# EAGLE design mcb (EAGLE 7.6.0)
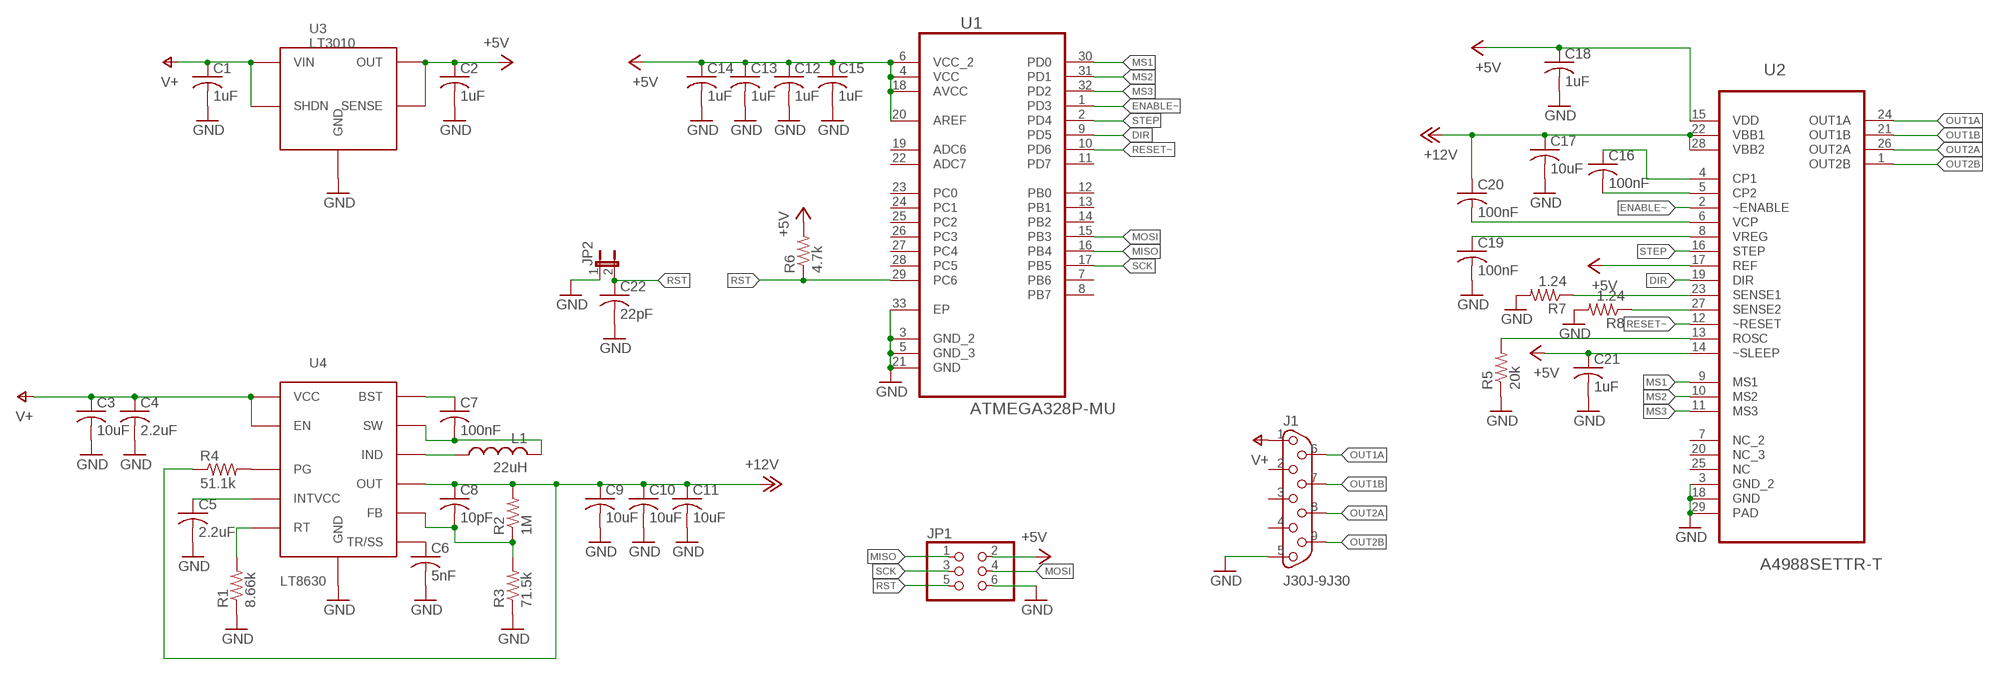
[diagram p0: schematic, sheet 1]

## Parts
C1  1uF  C-USC0603  [C0603]
C2  1uF  C-USC0603  [C0603]
C3  10uF  C-USC1206  [C1206]
C4  2.2uF  C-USC0805  [C0805]
C5  2.2uF  C-USC0805  [C0805]
C6  5nF  C-USC0603  [C0603]
C7  100nF  C-USC0603  [C0603]
C8  10pF  C-USC0603  [C0603]
C9  10uF  C-USC1206  [C1206]
C10  10uF  C-USC1206  [C1206]
C11  10uF  C-USC1206  [C1206]
C12  1uF  C-USC0603  [C0603]
C13  1uF  C-USC0603  [C0603]
C14  1uF  C-USC0603  [C0603]
C15  1uF  C-USC0603  [C0603]
C16  100nF  C-USC0603  [C0603]
C17  10uF  C-USC1206  [C1206]
C18  1uF  C-USC0603  [C0603]
C19  100nF  C-USC0603  [C0603]
C20  100nF  C-USC0603  [C0603]
C21  1uF  C-USC0603  [C0603]
C22  22pF  C-USC0603  [C0603]
J1  J30J-9J30  [ZKN-9-J30]
JP1  PINHD-2X3  [2X03]
JP2  JUMPER-2SMD-NO  [SJ_2S-NO]
L1  22uH  INDUCTOR  [SRP1265A]
R1  8.66k  R-US_R0603  [R0603]
R2  1M  R-US_R0603  [R0603]
R3  71.5k  R-US_R0603  [R0603]
R4  51.1k  R-US_R0603  [R0603]
R5  20k  R-US_R0603  [R0603]
R6  4.7k  R-US_R0603  [R0603]
R7  1.24  R-US_R0603  [R0603]
R8  1.24  R-US_R0603  [R0603]
U1  ATMEGA328P-MU  [QFN50P500X500X100-33N]
U2  A4988SETTR-T  [QFN50P500X500X100-29N]
U3  LT3010  [8-MSOP]
U4  LT8630  [20-TSSOP]

## Nets
+5V: C2.1 C12.1 C13.1 C14.1 C15.1 C18.1 C21.1 JP1.2 R6.2 U1.4(VCC) U1.6(VCC_2) U1.18(AVCC) U1.20(AREF) U2.14(~SLEEP) U2.15(VDD) U2.17(REF) U3.1(OUT) U3.2(SENSE)
+12V: C8.1 C9.1 C10.1 C11.1 C17.1 C20.1 R2.2 R4.1 U2.22(VBB1) U2.28(VBB2) U4.P$12(OUT)
DIR: U1.9(PD5) U2.19(DIR)
ENABLE~: U1.1(PD3) U2.2(~ENABLE)
GND: C1.2 C2.2 C3.2 C4.2 C5.2 C6.2 C9.2 C10.2 C11.2 C12.2 C13.2 C14.2 C15.2 C17.2 C18.2 C19.2 C21.2 C22.2 J1.5 JP1.6 JP2.1 R1.1 R3.1 R5.1 R7.2 R8.2 U1.3(GND_2) U1.5(GND_3) U1.21(GND) U1.33(EP) U2.3(GND_2) U2.18(GND) U2.29(PAD) U3.3(GND) U3.4(GND) U3.6(GND) U3.7(GND) U3.9(GND) U4.P$0(GND)
MISO: JP1.1 U1.16(PB4)
MOSI: JP1.4 U1.15(PB3)
MS1: U1.30(PD0) U2.9(MS1)
MS2: U1.31(PD1) U2.10(MS2)
MS3: U1.32(PD2) U2.11(MS3)
N$1: C6.1 U4.P$10(TR/SS)
N$2: C16.1 U2.4(CP1)
N$3: R4.2 U4.P$5(PG)
N$4: C5.1 U4.P$16(INTVCC)
N$5: R1.2 U4.P$8(RT)
N$6: R7.1 U2.23(SENSE1)
N$7: C7.1 U4.P$18(BST)
N$8: C7.2 L1.P$2 U4.P$20(SW)
N$9: C20.2 U2.6(VCP)
N$10: C8.2 R2.1 R3.2 U4.P$11(FB)
N$11: L1.P$1 U4.P$14(IND)
N$12: C16.2 U2.5(CP2)
N$13: R5.2 U2.13(ROSC)
N$14: C19.1 U2.8(VREG)
N$15: R8.1 U2.27(SENSE2)
OUT1A: J1.6 U2.24(OUT1A)
OUT1B: J1.7 U2.21(OUT1B)
OUT2A: J1.8 U2.26(OUT2A)
OUT2B: J1.9 U2.1(OUT2B)
RESET~: U1.10(PD6) U2.12(~RESET)
RST: C22.1 JP1.5 JP2.2 R6.1 U1.29(PC6)
SCK: JP1.3 U1.17(PB5)
STEP: U1.2(PD4) U2.16(STEP)
V+: C1.1 C3.1 C4.1 J1.1 U3.5(SHDN) U3.8(VIN) U4.P$1(VCC) U4.P$3(EN)
Unconnected: J1.2 J1.3 J1.4 U1.7(PB6) U1.8(PB7) U1.11(PD7) U1.12(PB0) U1.13(PB1) U1.14(PB2) U1.19(ADC6) U1.22(ADC7) U1.23(PC0) U1.24(PC1) U1.25(PC2) U1.26(PC3) U1.27(PC4) U1.28(PC5) U2.7(NC_2) U2.20(NC_3) U2.25(NC)

## Library data of the parts
C1-C22 = resistor:C-US: CAPACITOR, American symbol
J1 = CM_J30J:J30J-9
JP1 = pinhead:PINHD-2X3: PIN HEADER
JP2 = CM_passives:JUMPER-2: Jumper Basic 0.1" spaced jumper. Use with breakaway headers.
L1 = AR_passives:INDUCTOR
R1-R8 = resistor:R-US_: RESISTOR, American symbol
U1 = Atmel_By_element14_Batch_1-00:ATMEGA328P-MU: Programmable Flash; MPN: ATMEGA328P-MU; OC_FARNELL: 1748522; OC_NEWARK: 26R2526; PACKAGE: QFN-32; SUPPLIER: Atmel
U2 = Allegro_By_element14_Batch_1:A4988SETTR-T: DMOS Microstepping Driver with Translator and Overcurrent Protection; MPN: A4988SETTR-T; OC_FARNELL: -; OC_NEWARK: 67R9678; PACKAGE: QFN-28; SUPPLIER: Allegro
U3 = AR_IC:LT3010
U4 = AR_IC:LT8630

## Board
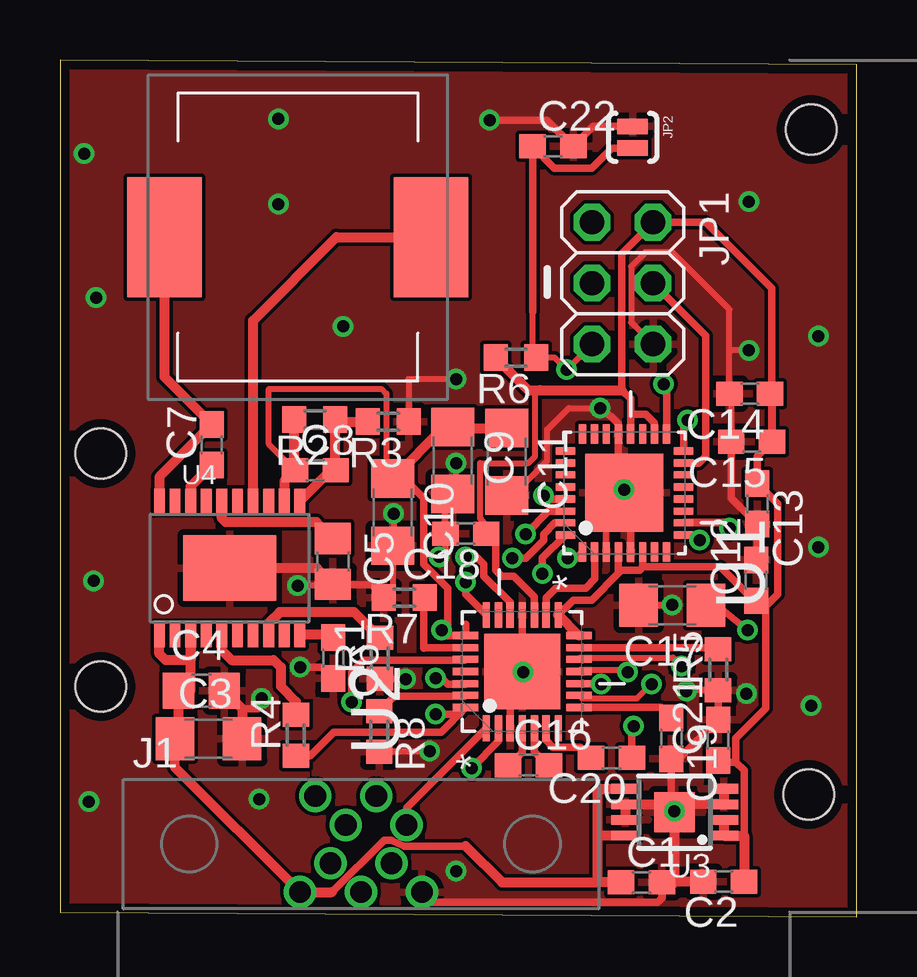
[diagram p1: board, top side]
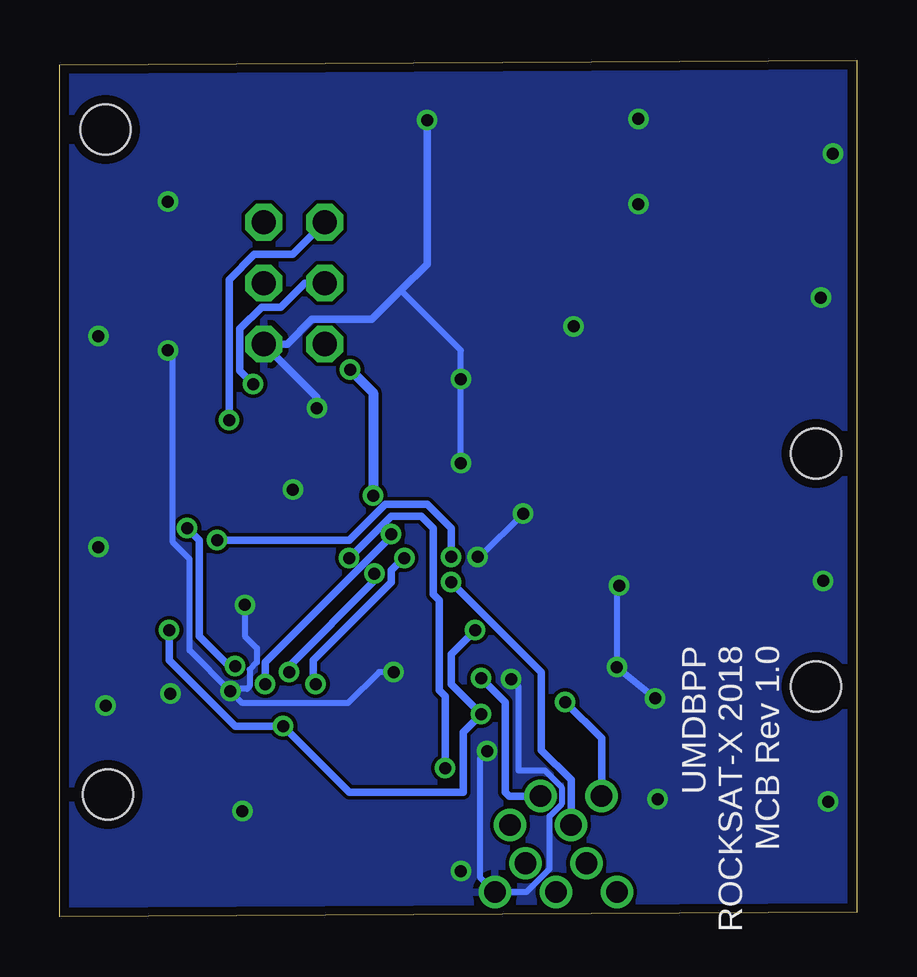
[diagram p2: board, bottom side, seen from below]

Size 33.2 x 35.7 mm. Coordinates in mm from the lower left corner, seen from the top.
Outline: 0,0.2 33.2,0 33.2,35.5 0,35.7 0,0.2
Copper layers (1*16): Top 0.0356mm / dielectric 1.5011mm / Bottom 0.0356mm
Design rules "oshpark-2layer": minimum track width 6mil, minimum drill 13mil, track to track 6mil, track to pad 6mil, pad to pad 6mil, via to via 6mil, smd to smd 6mil, copper to edge 15mil, drill to drill 6mil, minimum pad ring 7mil, minimum via ring 7mil, stop-mask expansion 2.5mil, vias tented up to drill 0mil, thermal gap 10mil
Holes 2.1 mm at 31.3,32.8 31.2,5.1 1.7,9.6 1.7,19.3

### Footprints (pad centres in the part's own frame; a part is rotated, then mirrored left to right if it is on the bottom)
C0603 = smd 1.1 x 1: 1 -0.85,0; 2 0.85,0
C1206 = smd 1.6 x 1.8: 1 -1.4,0; 2 1.4,0
C0805 = smd 1.3 x 1.5: 1 -0.95,0; 2 0.95,0
ZKN-9-J30 = drill 0.9: 1 -2.54,-2; 2 -1.27,-0.8; 3 0,-2; 4 1.27,-0.8; 5 2.54,-2; 6 -1.905,2; 7 -0.635,0.8; 8 0.635,2; 9 1.905,0.8
2X03 = drill 1.016 octagon: 1 -2.54,-1.27; 2 -2.54,1.27; 3 0,-1.27; 4 0,1.27; 5 2.54,-1.27; 6 2.54,1.27
SJ_2S-NO = smd 0.635 x 1.27: 1 -0.45,0; 2 0.45,0
SRP1265A = smd 3.1 x 5: P$1 -5.55,0; P$2 5.55,0
R0603 = smd 1 x 1.1: 1 -0.85,0; 2 0.85,0
QFN50P500X500X100-33N = smd 0.813 x 0.305: 1 -2.464,1.753; 2 -2.464,1.245; 3 -2.464,0.762; 4 -2.464,0.254; 5 -2.464,-0.254; 6 -2.464,-0.762; 7 -2.464,-1.245; 8 -2.464,-1.753; 17 2.464,-1.753; 18 2.464,-1.245; 19 2.464,-0.762; 20 2.464,-0.254; 21 2.464,0.254; 22 2.464,0.762; 23 2.464,1.245; 24 2.464,1.753 | smd 0.305 x 0.813: 9 -1.753,-2.464; 10 -1.245,-2.464; 11 -0.762,-2.464; 12 -0.254,-2.464; 13 0.254,-2.464; 14 0.762,-2.464; 15 1.245,-2.464; 16 1.753,-2.464; 25 1.753,2.464; 26 1.245,2.464; 27 0.762,2.464; 28 0.254,2.464; 29 -0.254,2.464; 30 -0.762,2.464; 31 -1.245,2.464; 32 -1.753,2.464 | smd 3.251 x 3.251: 33 0,0
QFN50P500X500X100-29N = smd 1.067 x 0.305: 1 -2.362,1.499; 2 -2.362,0.991; 3 -2.362,0.508; 4 -2.362,0; 5 -2.362,-0.508; 6 -2.362,-0.991; 7 -2.362,-1.499; 15 2.362,-1.499; 16 2.362,-0.991; 17 2.362,-0.508; 18 2.362,0; 19 2.362,0.508; 20 2.362,0.991; 21 2.362,1.499 | smd 0.305 x 1.067: 8 -1.499,-2.362; 9 -0.991,-2.362; 10 -0.508,-2.362; 11 0,-2.362; 12 0.508,-2.362; 13 0.991,-2.362; 14 1.499,-2.362; 22 1.499,2.362; 23 0.991,2.362; 24 0.508,2.362; 25 0,2.362; 26 -0.508,2.362; 27 -0.991,2.362; 28 -1.499,2.362 | smd 3.15 x 3.15: 29 0,0
8-MSOP = smd 0.4 x 1.2: 1 -0.975,-2.05; 2 -0.325,-2.05; 3 0.325,-2.05; 4 0.975,-2.05; 5 0.975,2.05; 6 0.325,2.05; 7 -0.325,2.05; 8 -0.975,2.05 | smd 1.68 x 1.68: 9 0,0
20-TSSOP = smd 3.86 x 2.74: P$0 0,0 | smd 0.45 x 1.05: P$1 -2.925,-2.775; P$2 -2.275,-2.775; P$3 -1.625,-2.775; P$4 -0.975,-2.775; P$5 -0.325,-2.775; P$6 0.325,-2.775; P$7 0.975,-2.775; P$8 1.625,-2.775; P$9 2.275,-2.775; P$10 2.925,-2.775; P$11 2.925,2.775; P$12 2.275,2.775; P$13 1.625,2.775; P$14 0.975,2.775; P$15 0.325,2.775; P$16 -0.325,2.775; P$17 -0.975,2.775; P$18 -1.625,2.775; P$19 -2.275,2.775; P$20 -2.925,2.775

### Placement (x,y rotation side)
C1  24.23,1.43 0 top
C2  27.65,1.47 180 top
C3  6.19,7.42 0 top
C4  5.89,9.42 0 top
C5  11.37,14.81 270 top
C6  11.38,10.78 270 top
C7  6.33,19.67 90 top
C8  10.64,18.6 0 top
C9  16.37,19.01 270 top
C10  13.87,16.86 270 top
C11  18.62,18.96 270 top
C12  29,14.02 90 top
C13  29.05,17.21 270 top
C14  28.74,21.8 180 top
C15  28.82,19.8 180 top
C16  19.52,6.32 0 top
C17  25.51,12.98 180 top
C18  16.91,15.97 180 top
C19  25.47,7.43 270 top
C20  22.98,6.63 180 top
C21  27.42,7.36 90 top
C22  20.54,32.1 0 top
J1  12.54,3.03 0 top
JP1  23.44,26.4 270 top
JP2  23.86,32.48 270 top
L1  9.91,28.32 180 top
R1  13.33,10.77 90 top
R2  10.62,20.72 180 top
R3  13.68,20.63 180 top
R4  9.83,7.57 90 top
R5  27.42,10.29 90 top
R6  19,23.3 180 top
R7  14.34,13.3 180 top
R8  13.3,7.72 270 top
U1  23.52,17.66 90 top
U2  19.26,10.22 90 top
U3  25.61,4.36 90 top
U4  7.07,14.53 0 top

### Tracks (layer width: path | path; a pad name or v marks a point on that pad's centre or on a via)
+5V
  Top 0.254: 17.65,16.2 17.65,16.45 17.5,16.6 17.5,18.9 19.5,18.9 19.8,19.2 19.8,21.75 20,21.95
  Top 0.305: 23.77,20.95 23.77,21.58 23.4,21.95 23.4,27.63 JP1.2 26.91,28.94 29.65,26.2 29.65,19.78 | 23.77,20.95 U1.20 | U1.18 24.76,20.59 24.4,20.95 23.77,20.95 | C21.1 27.48,6.45 28.15,6.45 | 28.15,6.45 28.5,6.1 28.5,3.39 | U2.15 21.38,13.2 22.15,13.2 23.27,14.32 | 23.27,14.32 U1.4 | U1.6 24.28,14.58 | 24.28,14.58 24.15,14.45 23.4,14.45 23.27,14.32 | 24.28,14.58 27.52,14.58 28.93,13.17 C12.1 29.4,12.77 | 29.4,12.77 29.4,8.7 28.15,7.45 28.15,6.45 | 29.65,19.78 C15.1 29.67,21.72 C14.1 | 29.4,12.77 29.4,12.95 29.9,13.45 29.9,17.21 C13.1 29.05,19.18 29.65,19.78 | C18.1 18.15,15.58 | U2.17 19.77,13.33 18.9,14.2 18.4,14.2 18.15,14.45 18.15,15.58 | 18.15,15.58 18.15,15.7 17.65,16.2
  Top 0.406: C2.1 28.5,3.39 U3.1 U3.2 | U2.14 U2.15 | R6.2 19.5,21.95 20,21.95 23.4,21.95
+12V  (via drill 0.5)
  Top 0.254: C8.1 8.7,19.69 8.7,22 13.4,22 13.6,21.8 13.6,18.53 C10.1
  Top 0.305: R4.1 10.42,6.72 11.4,7.7 15.88,7.7 U2.28 16.63,8.45 v15.65,8.45 | 16.9,12.2 U2.22 16.13,11.72 v15.9,11.95 16.15,12.2 16.15,13.7 15.15,14.7 15.15,17.45 14.34,18.26 C10.1 | C17.1 27.37,12.98 v28.65,11.95 | v23.9,7.95 23.83,7.88 C20.1
  Top 0.406: U4.P$12 9.35,18.15 C8.1 9.77,18.62 R2.2 | C10.1 16.02,20.41 C9.1 16.42,20.36 C11.1
  Bottom 0.305: v15.9,11.95 16.9,10.95 16.9,9.7 v15.65,8.45 16.4,7.7 16.4,5.2 21.15,5.2 v23.9,7.95 25.9,7.95 28.65,10.7 v28.65,11.95
DIR  (via drill 0.5)
  Top 0.305: U1.9 26.44,15.91 v26.65,15.7 | U2.19 18.75,13.1 17.65,14.2 17.65,14.7 17.35,15 v16.9,15
  Bottom 0.305: v26.65,15.7 21.15,15.7 19.65,17.2 17.9,17.2 16.9,16.2 v16.9,15
ENABLE~  (via drill 0.5)
  Top 0.305: U2.2 18.27,7.32 v17.15,6.2 | v21.15,14.95 21.52,14.95 U1.1
  Bottom 0.305: v17.15,6.2 17.15,9.2 17.4,9.45 17.4,13.2 17.65,13.45 17.65,16.2 18.15,16.7 19.4,16.7 v21.15,14.95
GND  (via drill 0.5)
  Top 0.254: v16.5,18.9 16.5,17.74 C9.2 16.06,17.3 C18.2 16.06,15.26 v15.8,15 | v16.5,22.4 14.53,22.4 R3.1 | C15.2 27.97,21.8 C14.2 27.89,23.5 | 27.89,23.5 27.89,25.31 25.5,27.7 24.4,27.7 23.8,27.1 23.8,24.77 JP1.6 | R7.2 13.87,13.68 C10.2 13.9,15.49 v13.9,16.8 | R5.1 26.14,9.44 v26.1,9.4 | U1.3 22.76,16.9 U1.33 | R7.2 12.93,13.86 C5.2 | R7.2 12.99,13.8 v9.9,13.8 | R8.2 13.33,6.9 v15.4,6.9 | U2.3 18.75,9.65 v19.3,10.2 | v28.7,23.6 27.99,23.6 27.89,23.5 | C11.2 18.86,17.56 20.3,19 20.3,20.3 21.2,21.2 v22.5,21.2 | R1.1 13.35,9.9 v14.4,9.9 | C17.2 25.48,12.98 v25.5,13 24.13,13 C17.2
  Top 0.305: JP2.1 22.22,32.93 C22.2 20.29,33.2 v17.9,33.2 | U2.3 18.75,9.71 U2.29 U2.18 | 25.61,4.69 25.47,4.83 C19.2 25.79,6.58 C21.2 R5.1 | U1.5 23.77,17.41 U1.33 23.27,17.91 U1.21 23.27,20.53 22.6,21.2 v22.5,21.2 | C12.2 29.05,14.92 C13.2 27.97,17.44 C15.2 | C6.2 10.91,10.4 v10,10.4 | v8.4,9.1 8.27,8.67 7.59,8.67 | J1.5 15.51,0.6 24.9,0.6 25.1,0.8 25.1,1.5
  Top 0.406: U3.7 U3.6 25.61,4.69 | C1.2 25.61,1.43 25.61,1.47 | C2.2 25.61,1.47 | 25.61,1.47 U3.9 25.61,4.69 | 25.61,4.69 U3.3 U3.4 | C4.2 7.59,8.67 C3.2 | C5.2 10.7,14.53 U4.P$0
  Bottom 0.254: v16.5,18.9 v16.5,22.4 16.5,23.6 19,26.1 | v9.9,13.8 10,13.7 v10,10.4 | v15.4,6.9 15.7,6.6 15.7,1.65 J1.5 13.77,1.03 12.8,2 12.8,4.2 12.3,4.7 12.3,5.4 13,6.1 14.1,6.1 14.1,9.6 v14.4,9.9 | v19.3,10.2 19.9,10.2 21.2,8.9 25.6,8.9 v26.1,9.4 | v25.5,13 25.5,11.7 25,11.2 25,10.6 25.3,10.3 25.3,9.6 25.4,9.5 26.1,9.5 v26.1,9.4 | v26.1,9.4 27.8,11.1 27.8,14.9 28.5,15.6 28.5,23.4 v28.7,23.6 | v15.8,15 15.7,15 v13.9,16.8
  Bottom 0.305: v17.9,33.2 17.9,27.2 19,26.1 20.2,24.9 22.7,24.9 23.74,23.86 JP1.6 22.5,21.65 v22.5,21.2 | v10,10.4 v8.4,9.1
  other vias: 9.1,29.7 28.7,29.8 28.6,9.3 16.5,1.9 8.3,4.9 25.6,4.4 23.5,17.8 9.1,33.25 11.8,24.6 31.6,24.2 31.6,15.4 31.3,8.8 1.4,14 1.2,4.8 1.5,25.8 1,31.8
  pour Top: -1.9,38.2 35.9,37.3 36.6,-2.5 -1.9,-2.2
  pour Bottom: -1.6,36.5 33.7,36.5 33.7,-1.7 -1.6,-1.7
MISO  (via drill 0.5)
  Top 0.305: v26.15,20.7 25.98,20.53 U1.16
  Bottom 0.305: v26.15,20.7 26.15,26.55 25.1,27.6 23.51,27.6 JP1.1
MOSI
  Top 0.305: JP1.4 26.9,24.21 26.9,19.2 26.6,18.9 U1.15
MS1  (via drill 0.5)
  Top 0.254: U2.9 21.75,9.1 24.05,9.1 v24.65,9.7
  Top 0.305: U1.30 20.35,16.9 v19.4,15.95
  Bottom 0.305: v19.4,15.95 19.4,15.85 24.65,10.6 v24.65,9.7
MS2  (via drill 0.5)
  Top 0.305: 22.64,9.71 v22.55,9.7 22.54,9.71 U2.10 | U1.31 20.61,16.41 20.15,15.95 20.15,15.7 19.4,14.95 v18.85,14.95
  Bottom 0.305: v22.55,9.7 22.65,9.8 22.65,10.7 19.4,13.95 19.4,14.45 18.9,14.95 v18.85,14.95
MS3  (via drill 0.5)
  Top 0.254: U2.11 21.7,10.3 23.55,10.3 v23.65,10.2
  Top 0.305: 23.63,10.22 v23.65,10.2 | v20.1,14.3 20.1,14.95 U1.32
  Bottom 0.305: v23.65,10.2 23.65,10.45 20.1,14 v20.1,14.3
N$1
  Top 0.406: C6.1 11.26,11.75 U4.P$10
N$2
  Top 0.305: C16.1 19.26,6.86 U2.4
N$3
  Top 0.406: U4.P$5 6.74,11.1 7.15,10.7 8.9,10.7 9.2,10.4 9.2,9.6 9.83,8.97 R4.2 9.83,8.67
N$4
  Top 0.406: C5.1 10.68,16.45 6.9,16.45 6.74,16.61 U4.P$16
N$5
  Top 0.406: U4.P$8 8.7,12.24 9.15,12.7 12.25,12.7 R1.2
N$6
  Top 0.305: R7.1 15.15,13.26 15.15,11.2 15.16,11.21 U2.23
N$7
  Top 0.406: C7.1 5.45,17.93 U4.P$18
N$8
  Top 0.406: L1.P$2 4.36,22.49 C7.2 4.14,18.34 U4.P$20
N$9
  Top 0.305: U2.6 20.25,7.35 20.52,7.08 21.68,7.08 C20.2
N$10
  Top 0.406: U4.P$11 11.29,18.6 C8.2 11.47,18.62 R2.1 11.56,20.63 R3.2
N$11
  Top 0.406: U4.P$14 8.04,24.84 11.52,28.32 L1.P$1
N$12
  Top 0.305: C16.2 19.77,6.87 U2.5
N$13
  Top 0.305: U2.13 27.35,11.21 R5.2
N$14
  Top 0.305: U2.8 25.03,8.72 C19.1
N$15
  Top 0.305: R8.1 13.93,9.2 16.87,9.2 U2.27
OUT1A  (via drill 0.5)
  Top 0.305: U2.24 16.87,10.7 12.65,10.7 12.15,10.2 v12.15,8.95
  Bottom 0.305: v12.15,8.95 10.63,7.44 J1.6
OUT1B  (via drill 0.5)
  Top 0.305: U2.21 16.9,13.44 v16.9,13.95
  Bottom 0.305: v16.9,13.95 13.15,10.2 13.15,6.95 11.91,5.71 J1.7
OUT2A  (via drill 0.5)
  Top 0.305: U2.26 16.89,9.7 16.15,9.7 15.9,9.95 v15.65,9.95
  Bottom 0.305: v15.65,9.95 14.65,8.95 14.65,5.2 14.48,5.03 J1.8
OUT2B
  Top 0.305: U2.1 14.45,4.54 J1.9
RESET~  (via drill 0.5)
  Top 0.254: U2.12 21.69,10.8 25.55,10.8 v25.9,10.45
  Top 0.305: v27.9,16.2 27.68,16.41 U1.10 26.02,16.45 27.65,16.45 v27.9,16.2
  Bottom 0.305: v27.9,16.2 27.4,15.7 27.4,11.7 26.15,10.45 v25.9,10.45
RST  (via drill 0.5)
  Top 0.254: JP1.5 v21.11,22.8 20.61,23.3 R6.1 19.69,23.46 19.69,25.22
  Top 0.305: JP2.2 22.98,32.03 22.15,31.2 20.59,31.2 C22.1 19.69,25.22 | v20.15,17.55 20.29,17.41 U1.29
  Bottom 0.406: v21.11,22.8 20.15,21.84 v20.15,17.55
SCK  (via drill 0.5)
  Top 0.305: v25.15,22.2 25.27,22.08 U1.17
  Bottom 0.305: v25.15,22.2 25.7,22.75 25.7,24.5 24.8,25.4 24,25.4 23,26.4 JP1.3
STEP
  Top 0.305: U2.16 20.25,13.3 20.65,13.7 21.9,13.7 22.27,14.07 U1.2
V+
  Top 0.305: 11.33,1.03 13.5,3.2 13.8,3.2 14.35,2.95 16.9,2.95
  Top 0.406: C1.1 22.4,1.43 | 22.4,1.43 22.4,3.39 | 22.4,3.39 22.4,5.2 22.54,5.33 U3.5 | U3.8 22.4,3.39 | U4.P$1 4.14,10.96 4.4,10.7 5.45,10.7 U4.P$3 5.45,9.42 C4.1 4.94,7.7 4.9,7.7 4.9,7.42 C3.1 4.79,6.24 J1.1 11.33,1.03 | 16.9,2.95 18.42,1.43 22.4,1.43

### Text on the board
bPlace: UMDBPP / ROCKSAT-X 2018 / MCB Rev 1.0